# Altium schematic sheet PowerSupply.SchDoc: =ProjectTitle
size 297 x 209 mm; Address1: Address1; Address2: Address2; Address3: Address3; Address4: Address4; SheetNumber: 1; SheetTotal: 7; Scale: 1:1; DocumentType: Схема электрическая принципиальная
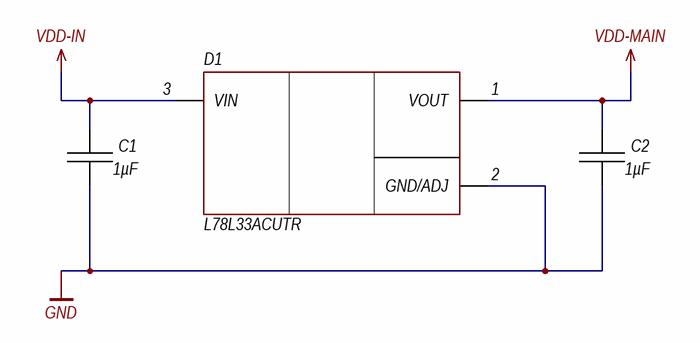
[diagram p0: PowerSupply.SchDoc]

## Parts
C1  1µF  [CH0603CM]
C2  1µF  [CH0603CM]
D1  L78L33ACUTR  [SOT89_123]

## Nets
GND: C1.1 C2.1 D1.2(GND/ADJ)
VDD-IN: C1.2 D1.3(VIN)
VDD-MAIN: C2.2 D1.1(VOUT)

## Notes on the sheet
- Утв.
- Н.контр.
- Т.контр.
- Пров.
- Разраб.
- Изм.
- Лист
- № докум.
- Подп.
- Дата
- Копировал
- Формат А4
- Лит.
- Листов
- Масса
- Масштаб

## Library data of the parts
C1 C2 = Capacitor: Manufacturer: *; Model: *; HelpURL: *; ComponentKind: *; Value: 1µF
D1 = L78LxxACUTR: LDO; Manufacturer: ST Microelectronics; Model: L78L33ACUTR; HelpURL: https://www.st.com/resource/en/datasheet/l78l.pdf; ComponentKind: SOT-89, 100mA